# Altium schematic sheet Schematic_基于NB-IoT的智能路灯系统.SchDoc
size 307 x 212 mm
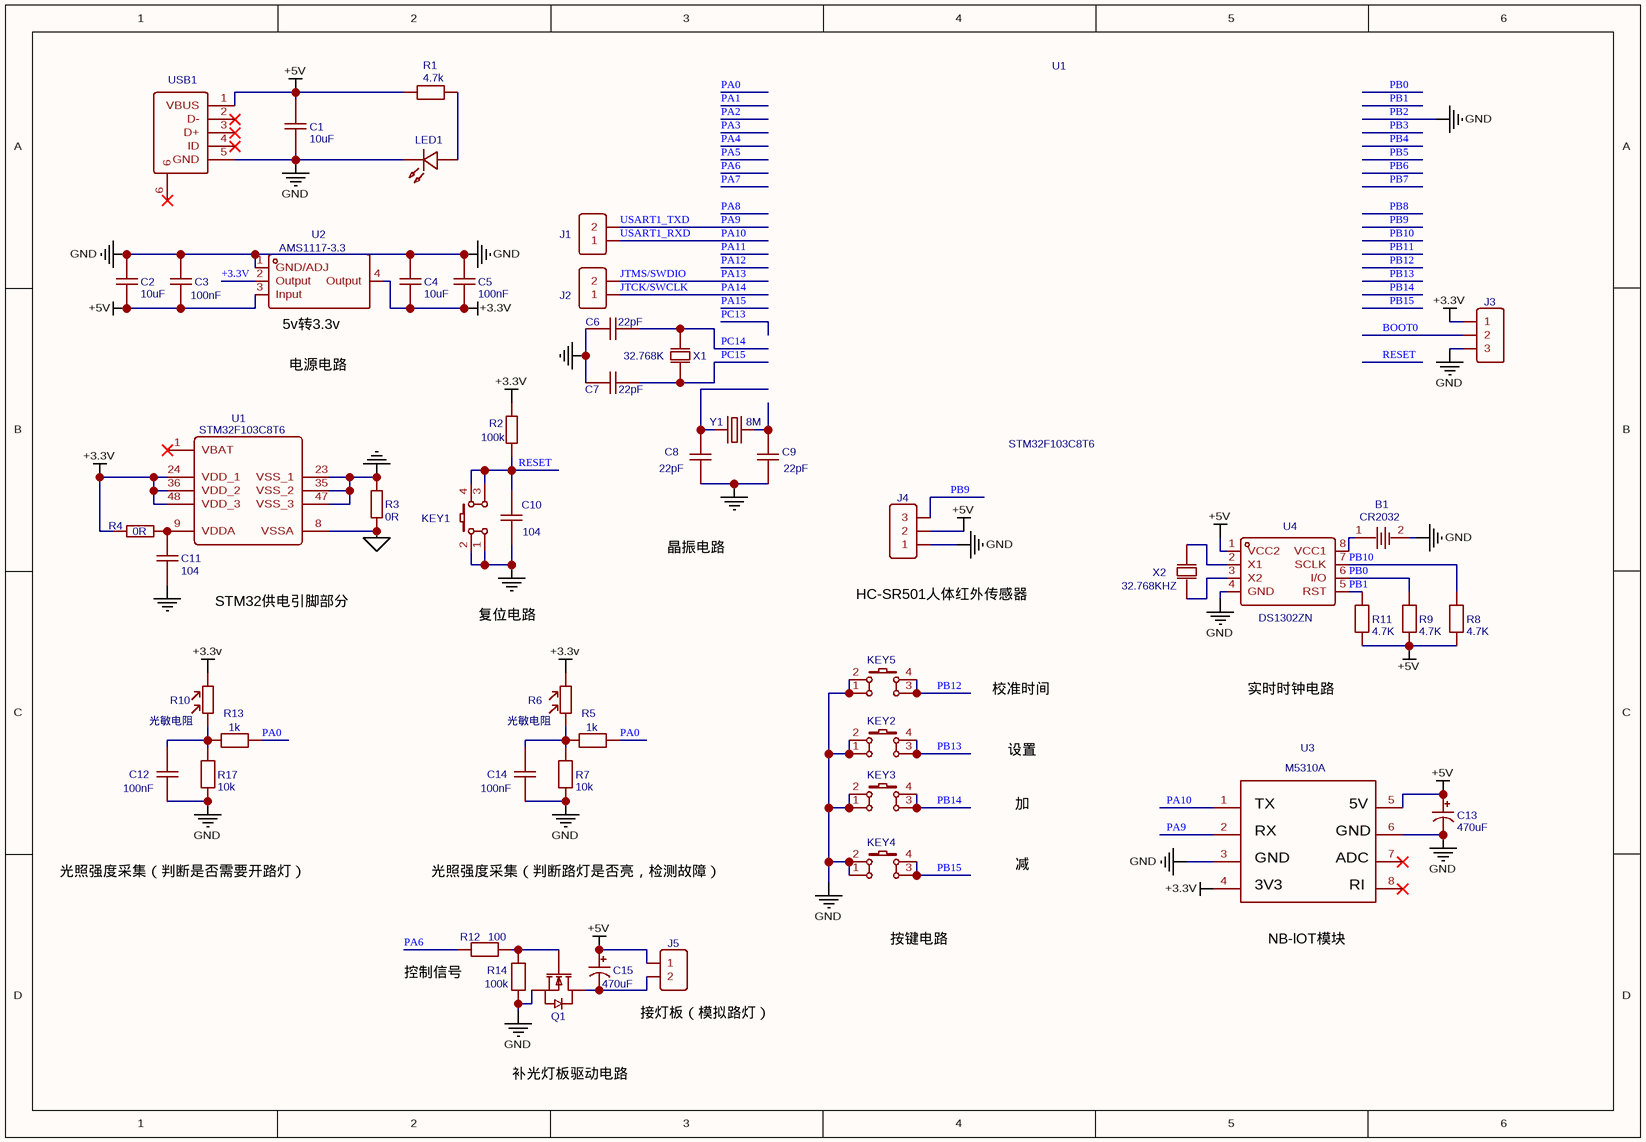
[diagram p0: Schematic_基于NB-IoT的智能路灯系统.SchDoc]

## Parts
(Parts that share a designator on the sheet are numbered #1, #2 ... from top to bottom, then left to right.)
B1  CR2032  [BAT-TH_BS-2-1]
C1  10uF  [C0805]
C2  10uF  [C0805]
C3  100nF  [C0805]
C4  10uF  [C0805]
C5  100nF  [C0805]
C6  22pF  [0603_C_JX]
C7  22pF  [0603_C_JX]
C8  22pF  [0603_C_JX]
C9  22pF  [0603_C_JX]
C10  104  [0603_C_JX]
C11  104  [0603_C_JX]
C12  100nF  [C0805]
C13  470uF  [CAP-TH_BD8.0-P3.50-D1.0-FD]
C14  100nF  [C0805]
C15  470uF  [CAP-TH_BD4.0-P1.50-D0.8-FD]
J1  HDR-M-2.54_1x2  [HDR-M-2.54_1X2]  (value not drawn)
J2  HDR-M-2.54_1x2  [HDR-M-2.54_1X2]  (value not drawn)
J3  HDR-M-2.54_1x3  [HDR-M-2.54_1X3]  (value not drawn)
J4  HDR-M-2.54_1x3  [HDR-M-2.54_1X3]  (value not drawn)
J5  接风扇  [HDR-M-2.54_1X2]  (value not drawn)
KEY1  K4-6×6_TH  [KEY-TH_4P-L6.0-W6.0-P4.50-LS6.5]  (value not drawn)
KEY2  K4-6×6_TH  [KEY-TH_4P-L6.0-W6.0-P4.50-LS6.5]  (value not drawn)
KEY3  K4-6×6_TH  [KEY-TH_4P-L6.0-W6.0-P4.50-LS6.5]  (value not drawn)
KEY4  K4-6×6_TH  [KEY-TH_4P-L6.0-W6.0-P4.50-LS6.5]  (value not drawn)
KEY5  K4-6×6_TH  [KEY-TH_4P-L6.0-W6.0-P4.50-LS6.5]  (value not drawn)
LED1  LED-TH-3mm_R  [LED-TH_BD3.0_RED]  (value not drawn)
Q1  AOD4184  [TO-252-2_L6.6-W6.1-P4.58-BR]  (value not drawn)
R1  4.7k  [R0805]
R2  100k  [0603_R_JX]
R3  0R  [0603_R_JX]
R4  0R  [0603_R_JX]
R5  1k  [R0805]
R6  光敏电阻  [RES-TH_L5.1-W4.3-P3.40_GL55]
R7  10k  [R0805]
R8  4.7K  [R_AXIAL-0.3]
R9  4.7K  [R_AXIAL-0.3]
R10  光敏电阻  [RES-TH_L5.1-W4.3-P3.40_GL55]
R11  4.7K  [R_AXIAL-0.3]
R12  100  [R0805]
R13  1k  [R0805]
R14  100k  [R0805]
R17  10k  [R0805]
U1#1  STM32F103C8T6  [STM32F103C8/C6-LQFP-48]
U1#2  STM32F103C8T6  [LQFP48_JX]
U2  AMS1117-3.3  [SOT-223-4_L6.5-W3.5-P2.30-LS7.0-BR]
U3  M5310A  [M5310A]
U4  DS1302ZN  [DIP-8_L9.3-W6.4-P2.54-LS7.6-BL]
USB1  MICRO5.9MMUSB  [MICRO-USB-SMD_5P-P0.65-H-F_MICRO5.9MMUSB]  (value not drawn)
X1  32.768K  [OSC-TH_BD3.1-P0.8-D0.3]
X2  32.768KHZ  [OSC-TH_BD2.0-P0.50]
Y1  8M  [HC-49S_JX]

## Nets
+3.3V: C4.2 C5.1 J3.1 R2.1 R4.1 R6.2 R10.2 U1#2.24(VDD_1) U1#2.36(VDD_2) U1#2.48(VDD_3) U2.2(Output) U2.4(Output) U3.4
+5V: C1.1 C2.1 C3.1 C13.1 C15.1 J4.2 J5.1 R1.1 R8.1 R9.1 R11.1 U2.3(Input) U3.5 U4.1(VCC2) USB1.1(VBUS)
AGND: R3.1 U1#2.8(VSSA)
PB2: B1.2 C1.2 C2.2 C3.2 C4.1 C5.2 C6.2 C7.1 C8.2 C9.2 C10.1 C11.2 C12.2 C13.2 C14.2 J3.3 J4.1 KEY1.1 KEY1.2 KEY2.1 KEY2.2 KEY3.1 KEY3.2 KEY4.1 KEY4.2 KEY5.1 KEY5.2 LED1.2 Q1.3(S) R3.2 R7.2 R14.1 R17.2 U1#2.23(VSS_1) U1#2.35(VSS_2) U1#2.47(VSS_3) U2.1(GND/ADJ) U3.3 U3.6 U4.4(GND) USB1.5(GND)  [also labelled GND]
BOOT0: J3.2
JTCK/SWCLK: J2.1  [also labelled PA14]
JTMS/SWDIO: J2.2  [also labelled PA13]
PA0: R5.2 R13.2
PA6: R12.1
PA9: J1.2 U3.2  [also labelled USART1_TXD]
PA10: J1.1 U3.1  [also labelled USART1_RXD]
PB0: R9.2 U4.6(I/O)
PB1: R11.2 U4.5(RST)
PB9: J4.3
PB10: R8.2 U4.7(SCLK)
PB12: KEY5.3 KEY5.4
PB13: KEY2.3 KEY2.4
PB14: KEY3.3 KEY3.4
PB15: KEY4.3 KEY4.4
PC14: C6.1 X1.2(OSC2)
PC15: C7.2 X1.1(OSC1)
RESET: C10.2 KEY1.3 KEY1.4 R2.2
NetB1_1: B1.1 U4.8(VCC1)
NetC8_1: C8.1 Y1.1
NetC9_1: C9.1 Y1.2
NetC11_1: C11.1 R4.2 U1#2.9(VDDA)
NetC12_1: C12.1 R10.1 R13.1 R17.1
NetC14_1: C14.1 R5.1 R6.1 R7.1
NetC15_2: C15.2 J5.2 Q1.2(D)
NetLED1_1: LED1.1 R1.2
NetQ1_1: Q1.1(G) R12.2 R14.2
NetU4_2: U4.2(X1) X2.1(OSC1)
NetU4_3: U4.3(X2) X2.2(OSC2)

Not connected (* = marked no-connect by the designer): U1#2 1(VBAT)*; U3 7* 8*; USB1 2(D-)* 3(D+)* 4(ID)* 6*

## Notes on the sheet
- (near U2) 5v转3.3v
- 电源电路
- 晶振电路
- STM32供电引脚部分
- 复位电路
- (near J4) HC-SR501人体红外传感器
- 设置
- 校准时间
- 实时时钟电路
- 加
- 光照强度采集（判断是否需要开路灯）
- 光照强度采集（判断路灯是否亮，检测故障）
- 减
- 按键电路
- (near U3) NB-lOT模块
- (near R12) 控制信号
- (near J5) 接灯板（模拟路灯）
- 补光灯板驱动电路
- (in symbol M5310A) TX; 5V; RX; GND; ADC; 3V3; RI

## Library data of the parts
B1 = CR2032: Manufacturer: Q&J; Manufacturer Part: BS-2-1; Supplier: LCSC; image: //image.lceda.cn/szlcsc/C70376.jpg; Supplier Part: C70376; spicePre: B; spiceSymbolName: CR2032-BS-2-1
C1 C2 C4 = 10uF: Manufacturer: HEC(Holy Stone Enterprise); Manufacturer Part: C0805X104K101T; nameAlias: Capacitance; Contributor: LCSC; Supplier: LCSC; Supplier Part: C485772; spicePre: C; spiceSymbolName: C0805X104K101T_C485772
C3 C5 C12 C14 = 100nF: Manufacturer: HEC(Holy Stone Enterprise); Manufacturer Part: C0805X104K101T; nameAlias: Capacitance; Contributor: LCSC; Supplier: LCSC; Supplier Part: C485772; spicePre: C; spiceSymbolName: C0805X104K101T_C485772
C6 C7 = 22pF: Manufacturer Part: C1644; nameAlias: Value(F); spicePre: C; spiceSymbolName: Capacitor
C8 C9 = 22pF: Manufacturer Part: C1653; nameAlias: Value(F); spicePre: C; spiceSymbolName: Capacitor
C10 C11 = 104: Manufacturer Part: C14663; nameAlias: Value(F); spicePre: C; spiceSymbolName: Capacitor
C13 = 470uF: Manufacturer: ValuePro; Manufacturer Part: 470uF 10V 8*12; nameAlias: Capacitance; Supplier: LCSC; Supplier Part: C43324; spicePre: C; spiceSymbolName: 470uF 10V 8*12
C15 = 470uF: Manufacturer: ValuePro; Manufacturer Part: 10uF 25V 4*7; nameAlias: Capacitance; Supplier: LCSC; Supplier Part: C43351; spicePre: C; spiceSymbolName: 10uF 25V 4*7
J1 J2 = HDR-M-2.54_1x2: Contributor: LCEDA_Lib; Supplier Part: C124375; Supplier: LCSC; spicePre: J; spiceSymbolName: HDR-M-2.54_1x2
J3 J4 = HDR-M-2.54_1x3: Contributor: LCEDA_Lib; Supplier Part: C180248; Supplier: LCSC; spicePre: J; spiceSymbolName: HDR-M-2.54_1x3
J5 = 接风扇: Contributor: LCEDA_Lib; Supplier Part: C124375; Supplier: LCSC; spicePre: J; spiceSymbolName: HDR-M-2.54_1x2
KEY1-KEY5 = K4-6×6_TH: Manufacturer: 韩国韩荣; Manufacturer Part: K2-1102DP-E4SW-04; Contributor: LCEDA_Lib; Supplier: LCSC; Supplier Part: C136684; spicePre: K; spiceSymbolName: K4-6×6_TH
LED1 = LED-TH-3mm_R: Manufacturer: EVERLIGHT(台湾亿光); Manufacturer Part: 204-10SDRD/S530-A3-L; Contributor: LCEDA_Lib; Supplier Part: C84774; Supplier: LCSC; spicePre: L; spiceSymbolName: LED-TH-3mm_R
Q1 = AOD4184: Manufacturer: VBsemi Elec; Contributor: LCSC; Supplier: LCSC; Supplier Part: C879026; Manufacturer Part: AOD4184; spicePre: Q; spiceSymbolName: AOD4184
R1 = 4.7k: nameAlias: Value(Ω); Contributor: LCEDA_Lib; spicePre: R; spiceSymbolName: R_0805_EU
R2 = 100k: Manufacturer Part: C25803; nameAlias: Value(Ω); spicePre: R; spiceSymbolName: Resistor; Supplier: EasyEDA
R3 R4 = 0R: Manufacturer Part: C21189; nameAlias: Value(Ω); spicePre: R; spiceSymbolName: Resistor
R5 R13 = 1k: nameAlias: Value(Ω); Contributor: LCEDA_Lib; spicePre: R; spiceSymbolName: R_0805_EU
R6 R10 = 光敏电阻: Manufacturer: ReliaPro; Manufacturer Part: GL5539(40-50); Supplier: LCSC; Supplier Part: C10079; spicePre: R; spiceSymbolName: GL5539(40-50)
R7 R17 = 10k: nameAlias: Value(Ω); Contributor: LCEDA_Lib; spicePre: R; spiceSymbolName: R_0805_EU
R8 R9 R11 = 4.7K: nameAlias: Value(Ω); Contributor: LCEDA_Lib; spicePre: R; spiceSymbolName: R_AXIAL-0.3_EU
R12 = 100: nameAlias: Value(Ω); Contributor: LCEDA_Lib; spicePre: R; spiceSymbolName: R_0805_EU
R14 = 100k: nameAlias: Value(Ω); Contributor: LCEDA_Lib; spicePre: R; spiceSymbolName: R_0805_EU
U1#1 U1#2 = STM32F103C8T6: Manufacturer: ST; tags: STM32; catid: 20; timeStamp: 1455028086; Supplier: EasyEDA; Manufacturer Part: STM32F103C8T6; spicePre: U; Supplier Part: E8734
U2 = AMS1117-3.3: Manufacturer: KEXIN; Contributor: LCSC; SMT Type: Extend; Supplier: LCSC; Supplier Part: C369933; Manufacturer Part: AMS1117-3.3; JLCPCB SMD: Yes; spicePre: U; spiceSymbolName: AMS1117-3.3_C369933
U3 = M5310A: Contributor: BuCuo; spicePre: U; spiceSymbolName: M5310A
U4 = DS1302ZN: Manufacturer: HGSEMI; Contributor: LCSC; Supplier: LCSC; Supplier Part: C910858; Manufacturer Part: DS1302ZN; spicePre: U; spiceSymbolName: DS1302ZN
USB1 = MICRO5.9MMUSB: Manufacturer: SHOU HAN; Contributor: LCSC; Supplier: LCSC; Supplier Part: C393940; Manufacturer Part: MICRO5.9mmusb; spicePre: U; spiceSymbolName: MICRO5.9MMUSB
X1 = 32.768K: Manufacturer: KDS Daishinku; Manufacturer Part: 1TC125DFNS019; nameAlias: Value; Contributor: LCSC; Supplier: LCSC; Supplier Part: C213421; JLCPCB Part Class: Extended Part; spicePre: X; spiceSymbolName: 1TC125DFNS019
X2 = 32.768KHZ: Manufacturer: Seiko; Manufacturer Part: VT-200-F-32.768kHz-20PPM-12.5pF; Contributor: LCSC; SMT Type: Extend; Supplier: LCSC; Supplier Part: C398714; JLCPCB SMD: Yes; spicePre: X; spiceSymbolName: VT-200-F-32.768KHZ-20PPM-12.5PF
Y1 = 8M: catid: 20; Contributor: SparkFun; Manufacturer Part: ?; spicePre: Y